# EasyEDA Pro project TCA6408A.epro

# Schematic TCA6408A
Create Date: 2024-03-03; Page Name: P1; Project Name: TCA6408A; Schematic Name: Schematic1; Update Date: 2024-03-03; Company: 嘉立创EDA; Page Size: A4; Version: V1.0
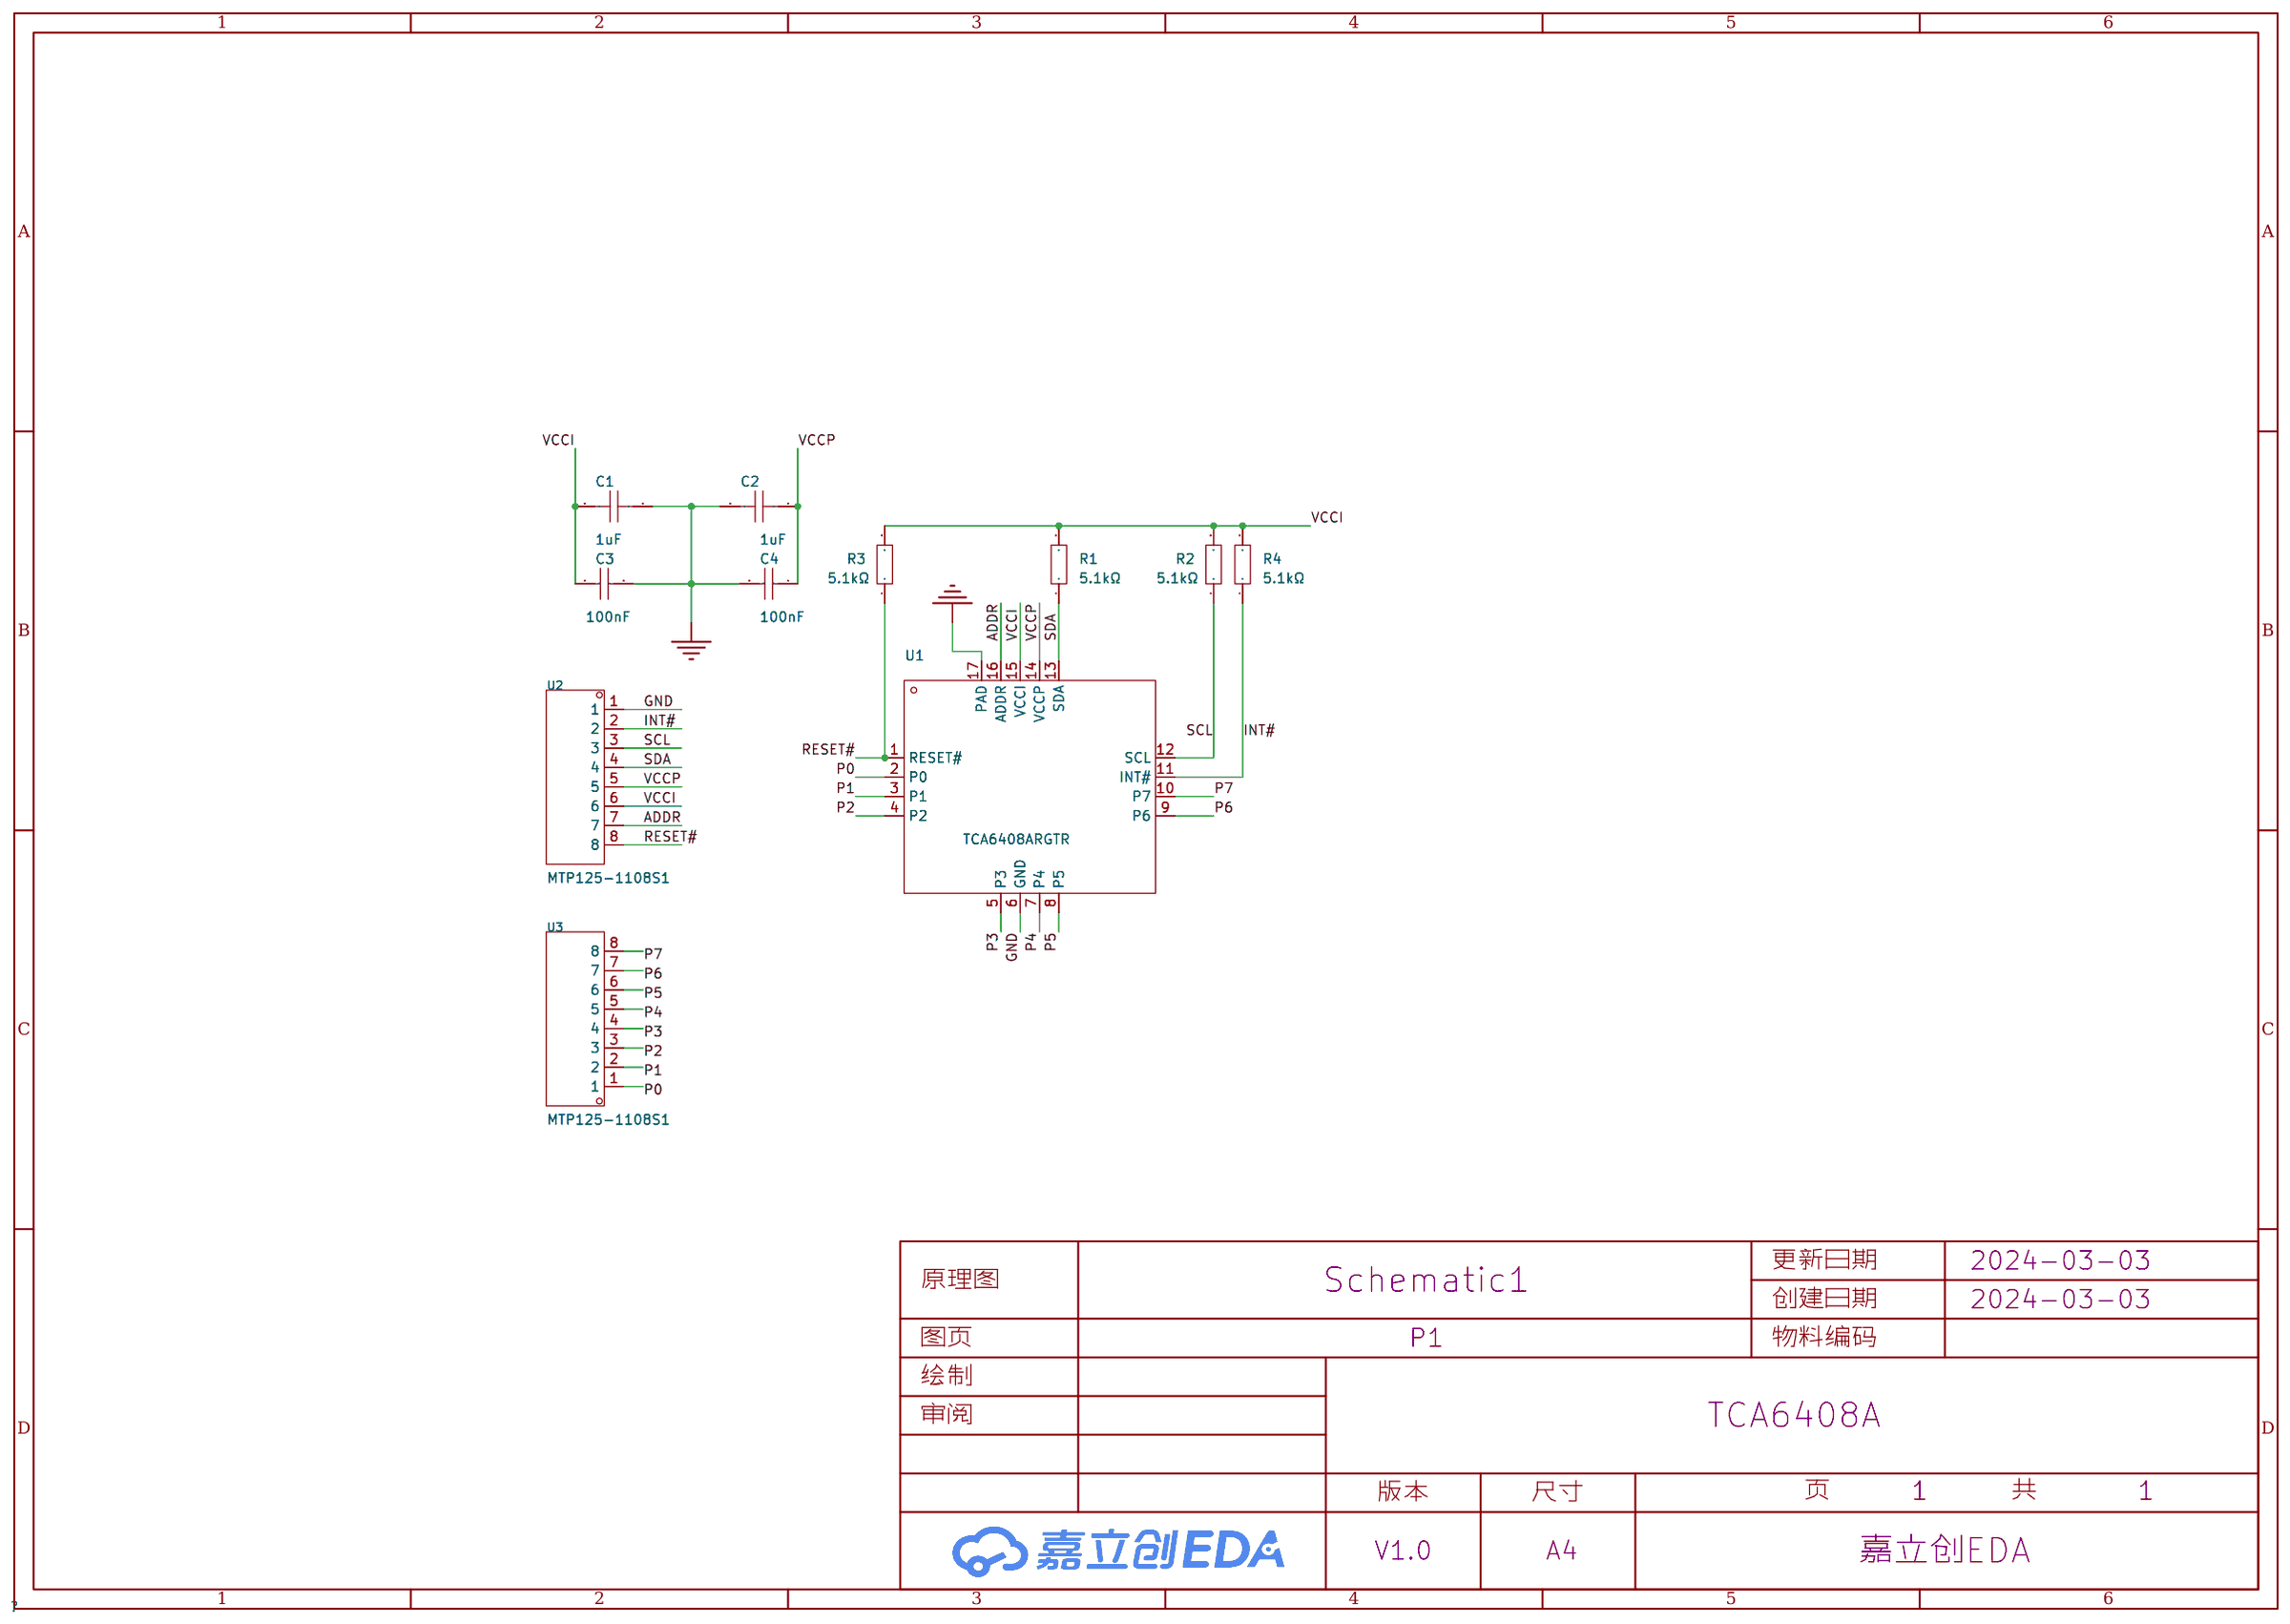
[diagram p0: schematic sheet]

## Parts
C1  1uF  [C0402]
C2  1uF  [C0402]
C3  100nF  [C0402]
C4  100nF  [C0402]
R1  5.1kΩ  [R0402]
R2  5.1kΩ  [R0402]
R3  5.1kΩ  [R0402]
R4  5.1kΩ  [R0402]
U1  TCA6408ARGTR  [QFN-16_L3.0-W3.0-P0.50-BL-EP1.7]
U2  MTP125-1108S1  [HDR-TH_8P-P2.54-H-M]
U3  MTP125-1108S1  [HDR-TH_8P-P2.54-H-M]

## Library data of the parts
C1 C2 = CL05A105KA5NQNC: 容值:1uF;精度:±10%;额定电压:25V;材质(温度系数):X5R;; LCSC Part Name: 1uF ±10% 25V; Supplier Part: C52923; Manufacturer: SAMSUNG(三星); Supplier Footprint: 0402; JLCPCB Part Class: Basic Part; Datasheet: https://atta.szlcsc.com/upload/public/pdf/source/20160218/1457707763339.pdf; Supplier: LCSC; Tolerance: ±10%; Voltage Rated: 25V; Temperature Coefficient: X5R
C3 C4 = CL05B104KO5NNNC: 容值:100nF;精度:±10%;额定电压:16V;材质(温度系数):X7R;; LCSC Part Name: 100nF ±10% 16V; Supplier Part: C1525; Manufacturer: SAMSUNG(三星); Supplier Footprint: 0402; JLCPCB Part Class: Basic Part; Datasheet: https://atta.szlcsc.com/upload/public/pdf/source/20160218/1457707763339.pdf; Supplier: LCSC; Tolerance: ±10%; Voltage Rated: 16V; Temperature Coefficient: X7R
R1-R4 = 0402WGF5101TCE: 电阻类型:厚膜电阻;阻值:5.1kΩ;精度:±1%;功率:62.5mW;最大工作电压:50V;温度系数:±100ppm/℃;; LCSC Part Name: 5.1kΩ ±1% 62.5mW 厚膜电阻; Supplier Part: C25905; Manufacturer: UNI-ROYAL(厚声); Supplier Footprint: 0402; JLCPCB Part Class: Basic Part; Datasheet: https://atta.szlcsc.com/upload/public/pdf/source/20200306/C422600_1E6D84923E4A46A82E41ADD87F860B5C.pdf; Supplier: LCSC; Type: 厚膜电阻; Tolerance: ±1%; Power(Watts): 62.5mW; Overload Voltage (Max): 50V; Temperature Coefficient: ±100ppm/℃; Operating Temperature Range: -55℃~+155℃
U1 = TCA6408ARGTR: 接口:I2C；SMBus;I/O数量:8;时钟频率:400kHz;; Supplier Part: C181499; Manufacturer: TI(德州仪器); Supplier Footprint: QFN-16-EP(3x3); JLCPCB Part Class: Extended Part; Datasheet: https://www.ti.com/cn/lit/gpn/tca6408a; Supplier: LCSC; Interface: I2C；SMBus; Number of I/O: 8; Interrupt Output: 有中断输出; Output Type: 推挽式; Supply Voltage: 1.65V~5.5V; Output Source current: 10mA; Output Sink Current: 25mA; Clock Frequency: 400kHz; Operating Temperature: -40℃~+85℃
U2 U3 = MTP125-1108S1: 插针结构:1x8P;间距:2.54mm;行距:-;圆针/方针:方针;安装类型:直插;排数:单排;总PIN位数:8P;额定电流:-;额定电压:-;配合针长度:6mm;塑高:2.5mm;端接针长度:3mm;触头材质:黄铜;触头镀层:-;工作温度范围:-40℃~+105℃;颜色:黑色;; LCSC Part Name: 间距:2.54mm 1x8P 直插 方针; Supplier Part: C358689; Manufacturer: MINTRON(明硕); Supplier Footprint: 插件,P=2.54mm; JLCPCB Part Class: Extended Part; Datasheet: https://atta.szlcsc.com/upload/public/pdf/source/20190124/C358691_14EEE47B6F852A185E1BED738B24D535.pdf; Supplier: LCSC; Pin Structure: 1x8P; Pitch: 2.54mm; Circluar Pins/Square Pins: 方针; Mounting Type: 直插; Number of Rows: 单排; Number of Pins: 8P; Length of Mating Pin: 6mm; Insulation Height: 2.5mm; Length of End Connection Pin: 3mm; Contact Material: 黄铜; Operating Temperature Range: -40℃~+105℃; Color: 黑色

## Nets
GND: C1.1 C2.2 C3.1 C4.2 U1.6(GND) U1.17(PAD) U2.1
VCCI: C1.2 C3.2 R1.2 R2.2 R3.2 R4.2 U1.15(VCCI) U2.6
VCCP: C2.1 C4.1 U1.14(VCCP) U2.5
ADDR: U1.16(ADDR) U2.7
INT#: R4.1 U1.11(INT#) U2.2
P0: U1.2(P0) U3.1
P1: U1.3(P1) U3.2
P2: U1.4(P2) U3.3
P3: U1.5(P3) U3.4
P4: U1.7(P4) U3.5
P5: U1.8(P5) U3.6
P6: U1.9(P6) U3.7
P7: U1.10(P7) U3.8
RESET#: R3.1 U1.1(RESET#) U2.8
SCL: R2.1 U1.12(SCL) U2.3
SDA: R1.1 U1.13(SDA) U2.4

# Board PCB1
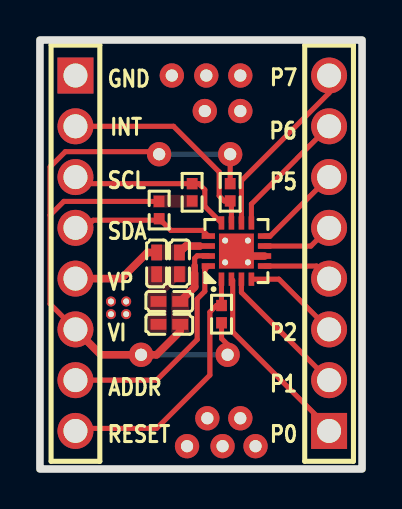
[diagram p1: board, top side]
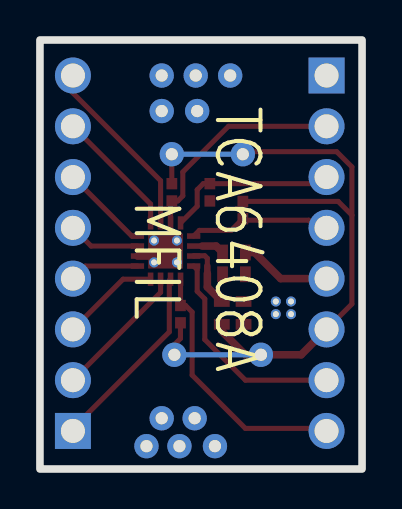
[diagram p2: board, bottom side, seen from below]

Outline 16.13 x 21.46 mm; copper layers: Top Layer, Bottom Layer. Coordinates in mm from the lower left corner of the outline.
Outline path: rectangle 0,21.46 16.13,0
Stack: Top Layer 0.035mm - / Dielectric1 1.51mm FR4 er 4.5 / Bottom Layer 0.035mm -

## Design rules (mm)
template: JLCPCB Capability(Two Layers Board)
spacing copperThickness1oz (default): track to track 0.102, other pairs 0.152 to 0.3
spacing copperThickness2oz: track to track 0.203, other pairs 0.152 to 0.3
track width copperThickness1oz (default): min 0.127, default 0.254, max 2.54
track width copperThickness2oz: min 0.203, default 0.254, max 2.54
differential pair differentialPair (default): width min 0.127, default 0.254, max 2.54; gap min 0.152, default 0.152
via viaSize (default): diameter min 0.5, default 0.61, max 10; hole min 0.3, default 0.305, max 6.3

## Placement (name value [footprint] x y rotation side)
C1  1uF  [C0402]  6.48 7.24 0 top
C2  1uF  [C0402]  5.84 10.29 270 top
C3  100nF  [C0402]  6.48 8.38 0 top
C4  100nF  [C0402]  6.98 10.29 270 top
NOREF  -  [Pad_e496]  3.56 7.75 0 top
NOREF#2  -  [Pad_e94]  9.27 11.43 0 top
NOREF#3  -  [Pad_e97]  9.27 10.34 0 top
NOREF#4  -  [Pad_e539]  8.38 2.54 0 top
NOREF#5  -  [Pad_e497]  4.32 7.75 0 top
NOREF#6  -  [Pad_e488]  8.33 19.69 0 top
NOREF#7  -  [Pad_e537]  7.37 1.14 0 top
NOREF#8  -  [Pad_e540]  10.03 2.54 0 top
NOREF#9  -  [Pad_e207]  9.52 15.75 0 top
NOREF#10  -  [Pad_e98]  10.41 10.34 0 top
NOREF#11  -  [Pad_e542]  10.79 1.14 0 top
NOREF#12  -  [Pad_e423]  5.97 15.75 0 top
NOREF#13  -  [Pad_e434]  5.06 5.72 0 top
NOREF#14  -  [Pad_e490]  8.25 17.91 0 top
NOREF#15  -  [Pad_e491]  10.03 17.91 0 top
NOREF#16  -  [Pad_e495]  4.32 8.38 0 top
NOREF#17  -  [Pad_e432]  9.4 5.72 0 top
NOREF#18  -  [Pad_e96]  10.41 11.43 0 top
NOREF#19  -  [Pad_e487]  6.6 19.69 0 top
NOREF#20  -  [Pad_e493]  3.56 8.38 0 top
NOREF#21  -  [Pad_e489]  10.03 19.69 0 top
NOREF#22  -  [Pad_e538]  9.14 1.14 0 top
R1  5.1kΩ  [R0402]  5.97 12.95 90 top
R2  5.1kΩ  [R0402]  7.62 13.84 270 top
R3  5.1kΩ  [R0402]  9.09 7.75 270 top
R4  5.1kΩ  [R0402]  9.52 13.84 90 top
U1  TCA6408ARGTR  [QFN-16_L3.0-W3.0-P0.50-BL-EP1.7]  9.84 10.9 0 top
U2  MTP125-1108S1  [HDR-TH_8P-P2.54-H-M]  1.78 10.8 270 top
U3  MTP125-1108S1  [HDR-TH_8P-P2.54-H-M]  14.48 10.8 90 top

## Footprints (pads in the part's own frame, mm; a bottom-side part is the same pattern mirrored in y, then rotated)
C0402
  rect 0.79x0.54 smd: 1(-0.545,0) 2(0.545,0)
HDR-TH_8P-P2.54-H-M
  rect 1.8x1.8 hole 1.2: 1(-8.89,0)
  round 1.8 hole 1.2: 2(-6.35,0) 3(-3.81,0) 4(-1.27,0) 5(1.27,0) 6(3.81,0) 7(6.35,0) 8(8.89,0)
Pad_e94
  round 0.5 hole 0.3: 20(0,0)
Pad_e96
  round 0.5 hole 0.3: 20(0,0)
Pad_e97
  round 0.5 hole 0.3: 20(0,0)
Pad_e98
  round 0.5 hole 0.3: 20(0,0)
Pad_e207
  round 1.219 hole 0.61: 18(0,0)
Pad_e423
  round 1.219 hole 0.61: 18(0,0)
Pad_e432
  round 1.219 hole 0.61: 18(0,0)
Pad_e434
  round 1.219 hole 0.61: 18(0,0)
Pad_e487
  round 1.219 hole 0.61: 19(0,0)
Pad_e488
  round 1.219 hole 0.61: 21(0,0)
Pad_e489
  round 1.219 hole 0.61: 22(0,0)
Pad_e490
  round 1.219 hole 0.61: 23(0,0)
Pad_e491
  round 1.219 hole 0.61: 24(0,0)
Pad_e493
  round 0.5 hole 0.3: 25(0,0)
Pad_e495
  round 0.5 hole 0.3: 25(0,0)
Pad_e496
  round 0.5 hole 0.3: 25(0,0)
Pad_e497
  round 0.5 hole 0.3: 25(0,0)
Pad_e537
  round 1.219 hole 0.61: 24(0,0)
Pad_e538
  round 1.219 hole 0.61: 24(0,0)
Pad_e539
  round 1.219 hole 0.61: 24(0,0)
Pad_e540
  round 1.219 hole 0.61: 24(0,0)
Pad_e542
  round 1.219 hole 0.61: 24(0,0)
QFN-16_L3.0-W3.0-P0.50-BL-EP1.7
  rect 0.28x0.665 smd: 1(-0.75,-1.407) 2(-0.25,-1.407) 3(0.25,-1.407) 4(0.75,-1.407) 9(0.75,1.407) 10(0.25,1.407) 11(-0.25,1.407) 12(-0.75,1.407)
  rect 0.665x0.28 smd: 5(1.407,-0.75) 6(1.407,-0.25) 7(1.407,0.25) 8(1.407,0.75) 13(-1.407,0.75) 14(-1.407,0.25) 15(-1.407,-0.25) 16(-1.407,-0.75)
  rect 1.75x1.75 smd: 17(0,0)
R0402
  rect 0.566x0.54 smd: 1(-0.433,0) 2(0.433,0)

## Nets
As in the schematic, except:
GND: C1.1 C2.2 C3.1 C4.2 NOREF.25 NOREF#2.20 NOREF#3.20 NOREF#4.24 NOREF#5.25 NOREF#6.21 NOREF#7.24 NOREF#8.24 NOREF#10.20 NOREF#11.24 NOREF#14.23 NOREF#15.24 NOREF#16.25 NOREF#18.20 NOREF#19.19 NOREF#20.25 NOREF#21.22 NOREF#22.24 U1.6 U1.17 U2.1
VCCI: C1.2 C3.2 NOREF#9.18 NOREF#12.18 NOREF#13.18 NOREF#17.18 R1.2 R2.2 R3.2 R4.2 U1.15 U2.6

## Routing (per net, layer and track width the routed paths; a pad name or vN(x,y) marks a point on that pad's centre or on a via; arc(x,y) is an arc through that point)
GND: length 1.5
  Top Layer w0.381: U1.17 10.09,10.65 U1.6
VCCI: length 41.1
  Top Layer w0.254: 0.51,12.7 1.19,13.39 R1.2 ; 0.51,12.7 0.51,15.11 1.27,15.88 5.84,15.88 NOREF#12.18 ; 0.51,12.7 0.51,8.25 U2.6 ; 9.09,7.31 9.09,6.53 9.4,6.22 NOREF#17.18 ; 7.75,10.16 7.75,10.54 7.87,10.67 8.42,10.67 U1.15 ; 9.52,14.28 NOREF#9.18
  Top Layer w0.33: 7.75,9.78 7.75,10.16
  Top Layer w0.381: C1.2 7.02,6.89 5.84,5.72 NOREF#13.18 3.05,5.72 U2.6 ; 7.75,9.78 7.75,9.11 C3.2
  Bottom Layer w0.254: NOREF#9.18 NOREF#12.18 ; NOREF#17.18 NOREF#13.18
VCCP: length 6.2
  Top Layer w0.127: U1.14 8,11.15
  Top Layer w0.381: U2.5 4.07,9.53 5.38,10.83 C2.1 ; 8,11.15 7.31,11.15 C4.1
ADDR: length 10.8
  Top Layer w0.254: U2.7 5.84,4.45 7.87,6.48 7.87,8.51 8.25,8.89 8.25,9.98 U1.16
INT#: length 11.1
  Top Layer w0.254: U2.2 6.69,17.14 8.98,14.86 8.98,13.66 9.23,13.41 R4.1 9.59,13.35 U1.11
P0: length 9.6
  Top Layer w0.254: U1.2 9.65,9.43 9.65,6.86 14.48,2.03 U3.1
P1: length 6.9
  Top Layer w0.254: U1.3 10.09,8.83 U3.2
P2: length 4.9
  Top Layer w0.254: U1.4 11.97,9.5 U3.3
P3: length 3.5
  Top Layer w0.254: U1.5 13.85,10.15 U3.4
P4: length 3.6
  Top Layer w0.254: U1.7 13.57,11.15 U3.5
P5: length 4.5
  Top Layer w0.254: U3.6 11.53,11.65 U1.8
P6: length 6.4
  Top Layer w0.254: U1.9 10.59,13.26 U3.7
P7: length 9.2
  Top Layer w0.254: U1.10 10.09,14.42 14.48,18.81 U3.8
RESET#: length 13.1
  Top Layer w0.254: U1.1 9.09,8.18 R3.1 8.84,8.18 8.51,7.85 8.51,4.7 5.84,2.03 1.9,2.03 U2.8
SCL: length 8.7
  Top Layer w0.254: U2.3 2.11,14.28 7.95,14.28 8.25,13.97 8.25,13.14 U1.12
SDA: length 7.2
  Top Layer w0.254: U2.4 2.29,12.06 2.67,12.45 5.89,12.45 R1.1 6.55,11.94 8.15,11.94 U1.13

## Copper pours and planes (outline as drawn; the poured copper is in the pictures)
GND on Top Layer: 5.4,10.14 7.33,10.14 7.33,6.81 5.4,6.81
GND on Top Layer: 0,21.46 16.13,21.46 16.13,0 0,0
GND on Bottom Layer: 0,21.46 16.13,21.46 16.13,0 0,0
VCCI on Top Layer: 6.58,8.84 7.47,8.84 7.47,6.83 6.58,6.83
VCCI on Top Layer: 5.66,13.72 7.91,13.72 7.91,13.08 5.66,13.08
VCCP on Top Layer: 5.58,11.23 7.21,11.23 7.21,10.46 5.58,10.46

## Text on the board
Bottom Silkscreen Layer: TCA6408A | MFIL
Top Silkscreen Layer: GND | SCL | SDA | VP | VI | RESET | ADDR | INT | P6 | P5 | P7 | P2 | P1 | P0
